# Altium schematic sheet VIDEO.schdoc
size 534 x 299 mm
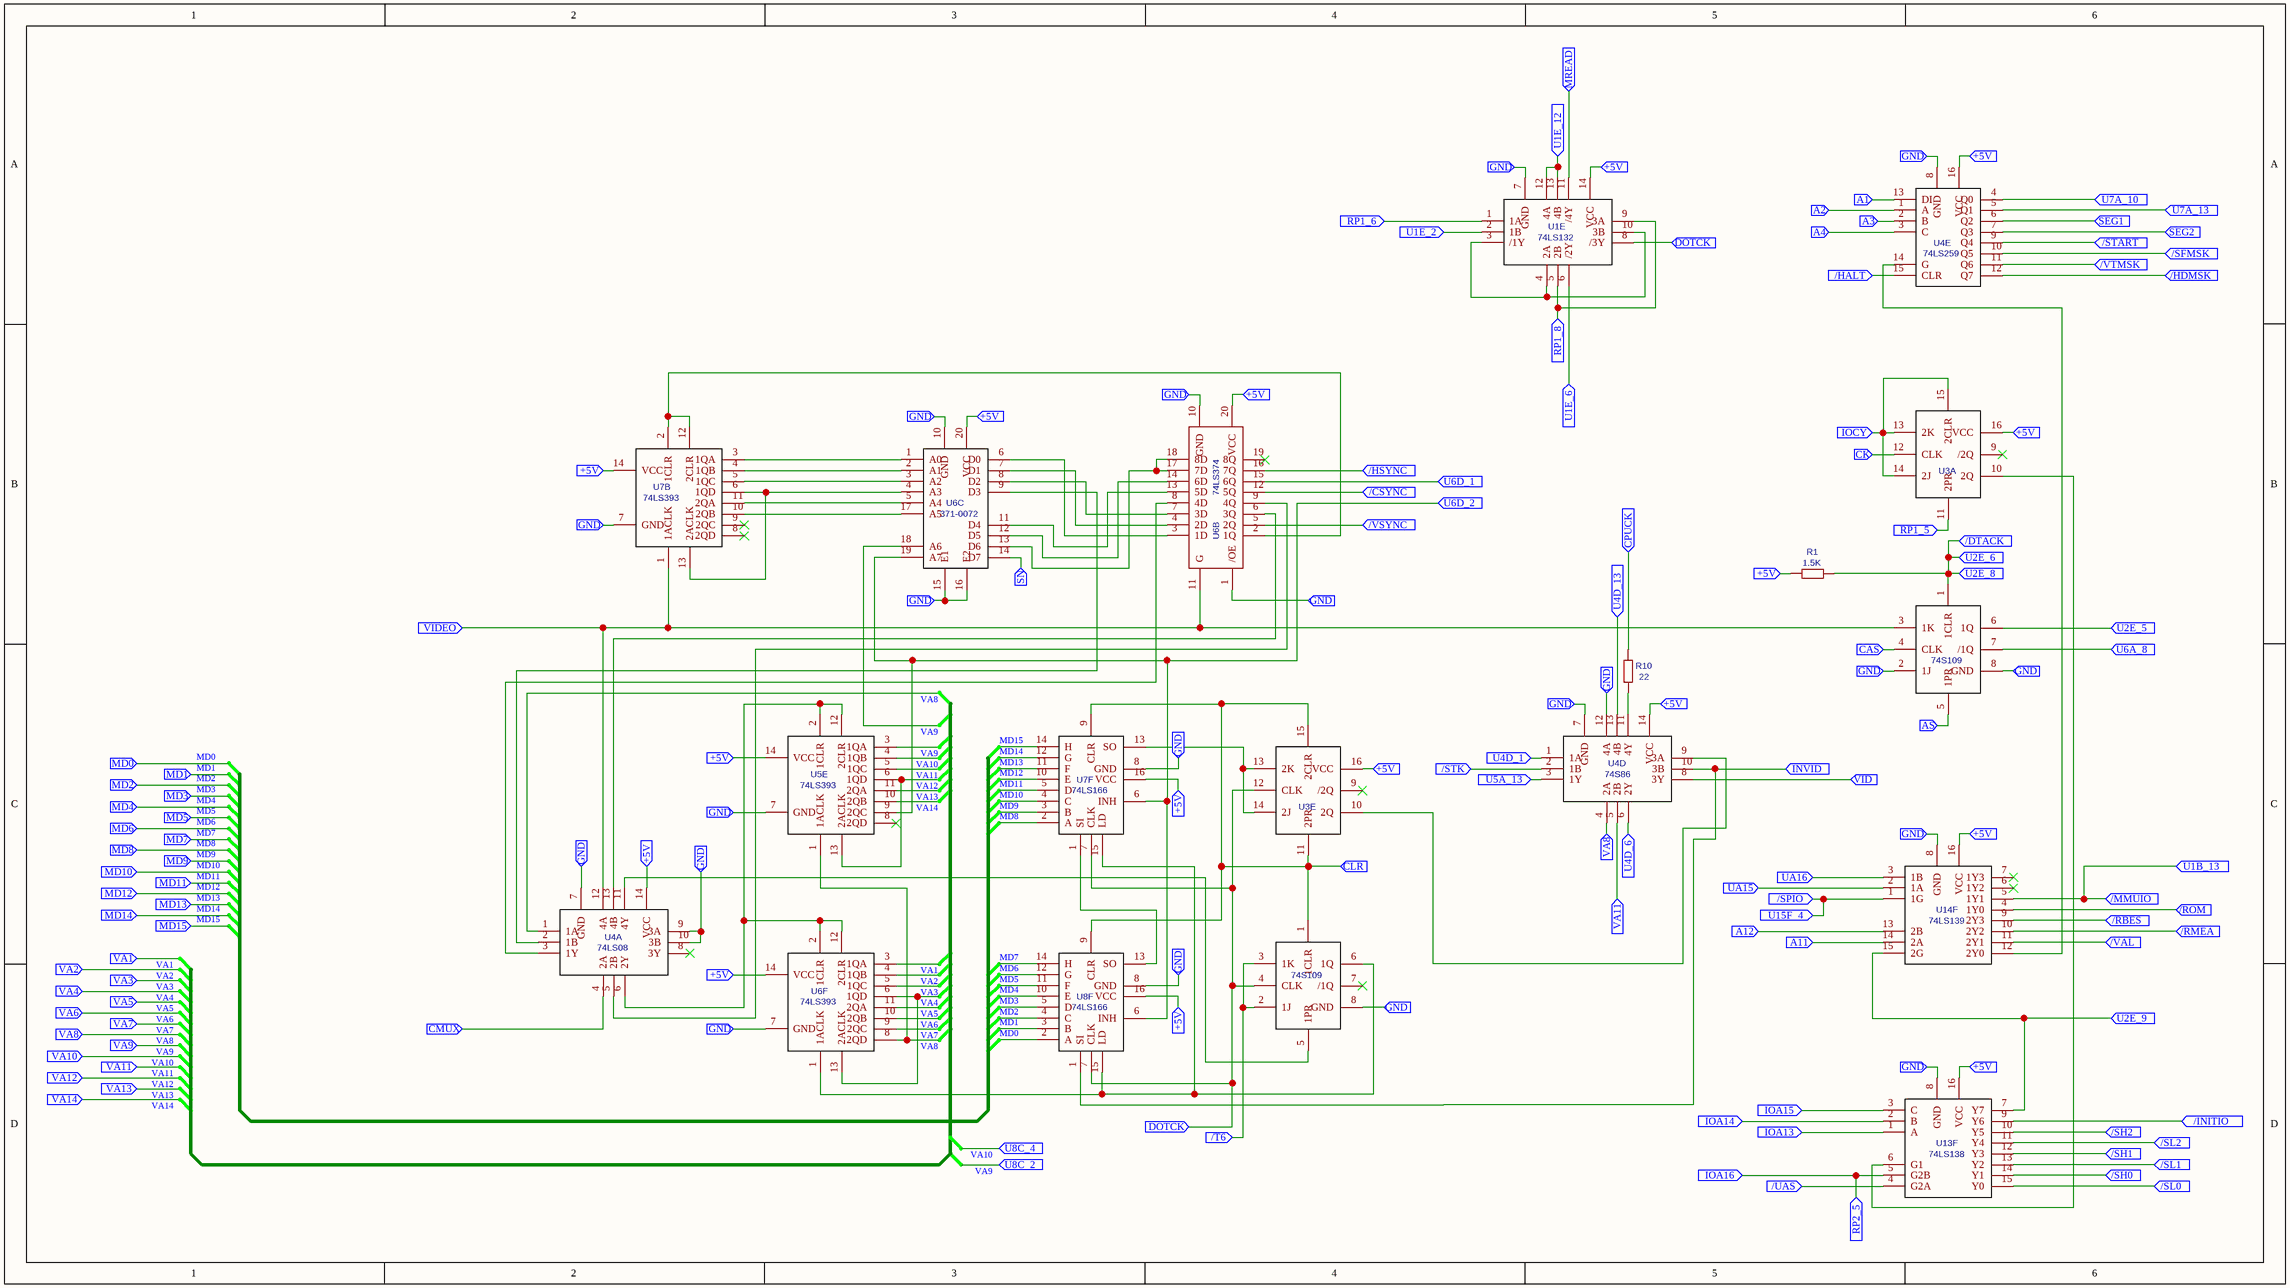
[diagram p0: VIDEO.schdoc]

## Parts
R1  1.5K  [LISA_RESISTOR]
R10  22  [LISA_RESISTOR]
U1E  74LS132  [LISA_DIP_14]
U3A  74S109  [LISA_DIP_16]
U3E  74S109  [LISA_DIP_16]
U4A  74LS08  [LISA_DIP_14]
U4D  74S86  [LISA_DIP_14]
U4E  74LS259  [LISA_DIP_16]
U5E  74LS393  [LISA_DIP_14]
U6B  74LS374  [LISA_DIP_20]
U6C  371-0072  [LISA_DIP_20]
U6F  74LS393  [LISA_DIP_14]
U7B  74LS393  [LISA_DIP_14]
U7F  74LS166  [LISA_DIP_16]
U8F  74LS166  [LISA_DIP_16]
U13F  74LS138  [LISA_DIP_16]
U14F  74LS139  [LISA_DIP_16]

## Ports
+5V (in), /CSYNC (in), /DTACK (in), /HALT (in), /HDMSK (in), /HSYNC (in), /INITIO (in), /MMUIO (in), /RBES (in), /RMEA (in), /ROM (in), /SFMSK (in), /SH0 (in), /SH1 (in), /SH2 (in), /SL0 (in), /SL1 (in), /SL2 (in), /SPIO (in), /START (in), /STK (in), /T6 (in), /UAS (in), /VAL (in), /VSYNC (in), /VTMSK (in), A1 (in), A2 (in), A3 (in), A4 (in), A11 (in), A12 (in), AS (in), CAS (in), CK (in), CLR (in), CMUX (in), CPUCK (in), DOTCK (in), GND (in), INVID (in), IOA13 (in), IOA14 (in), IOA15 (in), IOA16 (in), IOCY (in), MD0 (in), MD1 (in), MD2 (in), MD3 (in), MD4 (in), MD5 (in), MD6 (in), MD7 (in), MD8 (in), MD9 (in), MD10 (in), MD11 (in), MD12 (in), MD13 (in), MD14 (in), MD15 (in), MREAD (in), RP1_5 (in), RP1_6 (in), RP1_8 (in), RP2_5 (in), SEG1 (in), SEG2 (in), SN (in), U1B_13 (in), U1E_2 (in), U1E_6 (in), U1E_12 (in), U2E_5 (in), U2E_6 (in), U2E_8 (in), U2E_9 (in), U4D_1 (in), U4D_6 (in), U4D_13 (in), U5A_13 (in), U6A_8 (in), U6D_1 (in), U6D_2 (in), U7A_10 (in), U7A_13 (in), U8C_2 (in), U8C_4 (in), U15F_4 (in), UA15 (in), UA16 (in), VA1 (in), VA2 (in), VA3 (in), VA4 (in), VA5 (in), VA6 (in), VA7 (in), VA8 (in), VA9 (in), VA10 (in), VA11 (in), VA12 (in), VA13 (in), VA14 (in), VID (in), VIDEO (in)

## Nets
+5V: R1.2 U1E.14(VCC) U3A.16(VCC) U3E.16(VCC) U4A.14(VCC) U4D.14(VCC) U4E.16(VCC) U5E.14(VCC) U6B.20(VCC) U6C.20(VCC) U6F.14(VCC) U7B.14(VCC) U7F.16(VCC) U8F.16(VCC) U13F.16(VCC) U14F.16(VCC) ; port +5V
/CSYNC: U6B.12(5Q) ; port /CSYNC
/DTACK: R1.1 U3A.1(1CLR) ; port U2E_8, port U2E_6, port /DTACK
/HALT: U4E.15(CLR) ; port /HALT
/HDMSK: U4E.12(Q7) ; port /HDMSK
/HSYNC: U6B.16(7Q) ; port /HSYNC
/INITIO: U13F.9(Y6) ; port /INITIO
/MMUIO: U14F.5(1Y1) ; port /MMUIO, port U1B_13
/RBES: U14F.9(2Y3) ; port /RBES
/RMEA: U14F.10(2Y2) ; port /RMEA
/ROM: U14F.4(1Y0) ; port /ROM
/SFMSK: U4E.10(Q5) ; port /SFMSK
/SH0: U13F.14(Y1) ; port /SH0
/SH1: U13F.12(Y3) ; port /SH1
/SH2: U13F.10(Y5) ; port /SH2
/SL0: U13F.15(Y0) ; port /SL0
/SL1: U13F.13(Y2) ; port /SL1
/SL2: U13F.11(Y4) ; port /SL2
/SPIO: U14F.1(1G) ; port /SPIO, port U15F_4
/START: U4E.9(Q4) ; port /START
/STK: U4D.2(1B) ; port /STK
/T6: U3E.2(1J) U3E.3(1K) ; port /T6
/UAS: U13F.4(G2A) ; port /UAS
/VAL: U14F.11(2Y1) ; port /VAL
/VSYNC: U6B.5(2Q) ; port /VSYNC
/VTMSK: U4E.11(Q6) ; port /VTMSK
A1: U4E.13(DI) ; port A1
A2: U4E.1(A) ; port A2
A3: U4E.2(B) ; port A3
A4: U4E.3(C) ; port A4
A11: U14F.14(2A) ; port A11
A12: U14F.13(2B) ; port A12
AS: U3A.5(1PR) ; port AS
CAS: U3A.4(CLK) ; port CAS
CK: U3A.12(CLK) ; port CK
CLR: U3E.1(1CLR) U3E.11(2PR) U3E.15(2CLR) U7F.9(CLR) U8F.9(CLR) ; port CLR
CMUX: U4A.4(2A) ; port CMUX
CPUCK: R10.1 ; port CPUCK
DOTCK: U1E.5(2B) U1E.8(/3Y) U1E.9(3A) U3E.4(CLK) U3E.12(CLK) U7F.7(CLK) U8F.7(CLK) ; port DOTCK, port RP1_8
GND: U1E.7(GND) U3A.2(1J) U3A.8(GND) U3E.8(GND) U4A.7(GND) U4A.9(3A) U4A.10(3B) U4D.7(GND) U4D.12(4A) U4E.8(GND) U5E.7(GND) U6B.1(/OE) U6B.10(GND) U6C.10(GND) U6C.15(E1) U6C.16(E2) U6F.7(GND) U7B.7(GND) U7F.8(GND) U8F.8(GND) U13F.8(GND) U14F.8(GND) ; port GND
INVID: U4D.10(3B) U8F.1(SI) ; port INVID
IOA13: U13F.1(A) ; port IOA13
IOA14: U13F.2(B) ; port IOA14
IOA15: U13F.3(C) ; port IOA15
IOA16: U13F.5(G2B) ; port IOA16, port RP2_5
IOCY: U3A.13(2K) U3A.14(2J) U3A.15(2CLR) ; port IOCY
MD0: U8F.2(A) ; port MD0
MD1: U8F.3(B) ; port MD1
MD2: U8F.4(C) ; port MD2
MD3: U8F.5(D) ; port MD3
MD4: U8F.10(E) ; port MD4
MD5: U8F.11(F) ; port MD5
MD6: U8F.12(G) ; port MD6
MD7: U8F.14(H) ; port MD7
MD8: U7F.2(A) ; port MD8
MD9: U7F.3(B) ; port MD9
MD10: U7F.4(C) ; port MD10
MD11: U7F.5(D) ; port MD11
MD12: U7F.10(E) ; port MD12
MD13: U7F.11(F) ; port MD13
MD14: U7F.12(G) ; port MD14
MD15: U7F.14(H) ; port MD15
MREAD: U1E.11(/4Y) ; port MREAD
RP1_5: U3A.11(2PR) ; port RP1_5
RP1_6: U1E.1(1A) ; port RP1_6
SEG1: U4E.6(Q2) ; port SEG1
SEG2: U4E.7(Q3) ; port SEG2
SN: U6C.14(D7) ; port SN
U1E_2: U1E.2(1B) ; port U1E_2
U1E_6: U1E.6(/2Y) ; port U1E_6
U1E_12: U1E.12(4A) U1E.13(4B) ; port U1E_12
U2E_5: U3A.6(1Q) ; port U2E_5
U2E_9: U13F.7(Y7) U14F.15(2G) ; port U2E_9
U4D_1: U4D.1(1A) ; port U4D_1
U4D_6: U4D.6(2Y) ; port U4D_6
U4D_13: U4D.13(4B) ; port U4D_13
U5A_13: U4D.3(1Y) ; port U5A_13
U6A_8: U3A.7(/1Q) ; port U6A_8
U6D_1: U6B.15(6Q) ; port U6D_1
U6D_2: U5E.9(2QC) U6C.19(A7) U7F.6(INH) U8F.6(INH) ; port U6D_2
U7A_10: U4E.4(Q0) ; port U7A_10
U7A_13: U4E.5(Q1) ; port U7A_13
UA15: U14F.2(1A) ; port UA15
UA16: U14F.3(1B) ; port UA16
VA1: U6F.3(1QA) ; port VA1
VA2: U6F.4(1QB) ; port VA2
VA3: U6F.5(1QC) ; port VA3
VA4: U6F.6(1QD) U6F.13(2ACLK) ; port VA4
VA5: U6F.11(2QA) ; port VA5
VA6: U6F.10(2QB) ; port VA6
VA7: U6F.9(2QC) ; port VA7
VA8: U4A.1(1A) U4D.4(2A) U5E.1(1ACLK) U6F.8(2QD) ; port VA8
VA9: U5E.3(1QA) U6C.18(A6) ; port VA9, port U8C_2
VA10: U5E.4(1QB) ; port VA10, port U8C_4
VA11: U4D.5(2B) U5E.5(1QC) ; port VA11
VA12: U5E.6(1QD) U5E.13(2ACLK) ; port VA12
VA13: U5E.11(2QA) ; port VA13
VA14: U5E.10(2QB) ; port VA14
VID: U4D.8(3Y) ; port VID
VIDEO: U3A.3(1K) U4A.12(4A) U6B.11(G) U7B.1(1ACLK) ; port VIDEO
NetR10_2: R10.2 U4D.11(4Y)
NetU1E_3: U1E.3(/1Y) U1E.4(2A) U1E.10(3B)
NetU3A_10: U3A.10(2Q) U13F.6(G1)
NetU3E_5: U3E.5(1PR) U4A.11(4Y)
NetU3E_6: U3E.6(1Q) U6F.1(1ACLK) U7F.15(LD) U8F.15(LD)
NetU3E_10: U3E.10(2Q) U4D.9(3A)
NetU3E_13: U3E.13(2K) U3E.14(2J) U7F.13(SO)
NetU4A_2: U4A.2(1B) U6C.9(D3)
NetU4A_3: U4A.3(1Y) U6B.8(4D)
NetU4A_5: U4A.5(2B) U6B.9(4Q)
NetU4A_6: U4A.6(2Y) U5E.2(1CLR) U5E.12(2CLR) U6F.2(1CLR) U6F.12(2CLR)
NetU4A_13: U4A.13(4B) U6B.6(3Q)
NetU4E_14: U4E.14(G) U14F.12(2Y0)
NetU6B_2: U6B.2(1Q) U7B.2(1CLR) U7B.12(2CLR)
NetU6B_3: U6B.3(1D) U6C.6(D0)
NetU6B_4: U6B.4(2D) U6C.7(D1)
NetU6B_7: U6B.7(3D) U6C.8(D2)
NetU6B_13: U6B.13(5D) U6C.11(D4)
NetU6B_14: U6B.14(6D) U6C.12(D5)
NetU6B_17: U6B.17(7D) U6B.18(8D) U6C.13(D6)
NetU6C_1: U6C.1(A0) U7B.3(1QA)
NetU6C_2: U6C.2(A1) U7B.4(1QB)
NetU6C_3: U6C.3(A2) U7B.5(1QC)
NetU6C_4: U6C.4(A3) U7B.6(1QD) U7B.13(2ACLK)
NetU6C_5: U6C.5(A4) U7B.11(2QA)
NetU6C_17: U6C.17(A5) U7B.10(2QB)
NetU7F_1: U7F.1(SI) U8F.13(SO)

Not connected (* = marked no-connect by the designer): U3A 9(/2Q)*; U3E 7(/1Q)* 9(/2Q)*; U4A 8(3Y)*; U5E 8(2QD)*; U6B 19(8Q)*; U7B 8(2QD)* 9(2QC)*; U14F 6(1Y2)* 7(1Y3)*

## Library data of the parts
R1 = 1.5K: Contributor: William Tooker; spicePre: R; spiceSymbolName: LISA_CPU_RESISTOR
R10 = 22: Contributor: William Tooker; spicePre: R; spiceSymbolName: LISA_CPU_RESISTOR
U1E = 74LS132: Contributor: William Tooker; spicePre: U; spiceSymbolName: LISA_CPU_74LS132
U3A U3E = 74S109: Contributor: William Tooker; spicePre: U; spiceSymbolName: LISA_CPU_74S109
U4A = 74LS08: Contributor: William Tooker; spicePre: U; spiceSymbolName: LISA_CPU_74LS08
U4D = 74S86: Contributor: William Tooker; spicePre: U; spiceSymbolName: LISA_CPU_74S86
U4E = 74LS259: Contributor: William Tooker; spicePre: U; spiceSymbolName: LISA_CPU_74LS259
U5E U6F U7B = 74LS393: Contributor: William Tooker; spicePre: U; spiceSymbolName: LISA_CPU_74LS393
U6B = 74LS374: Contributor: William Tooker; spicePre: U; spiceSymbolName: LISA_CPU_74LS374
U6C = 371-0072: Contributor: William Tooker; spicePre: U; spiceSymbolName: LISA_CPU_371-0072_VIDEO_ROM
U7F U8F = 74LS166: Contributor: William Tooker; spicePre: U; spiceSymbolName: LISA_CPU_74LS166
U13F = 74LS138: Contributor: William Tooker; spicePre: U; spiceSymbolName: LISA_CPU_74LS138
U14F = 74LS139: Contributor: William Tooker; spicePre: U; spiceSymbolName: LISA_CPU_74LS139